# EAGLE schematic Ground_splitter (EAGLE 9.0.1)
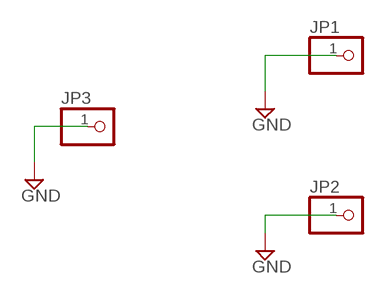
[diagram p0: schematic, sheet 1]

## Parts
JP1  PINHD-1X1  [1X01]
JP2  PINHD-1X1  [1X01]
JP3  PINHD-1X1  [1X01]

## Nets
GND: JP1.1 JP2.1 JP3.1

## Library data of the parts
JP1-JP3 = pinhead:PINHD-1X1: PIN HEADER